# Altium schematic sheet Master.SchDoc
size 431 x 279 mm; SheetNumber: 1; SheetTotal: 6
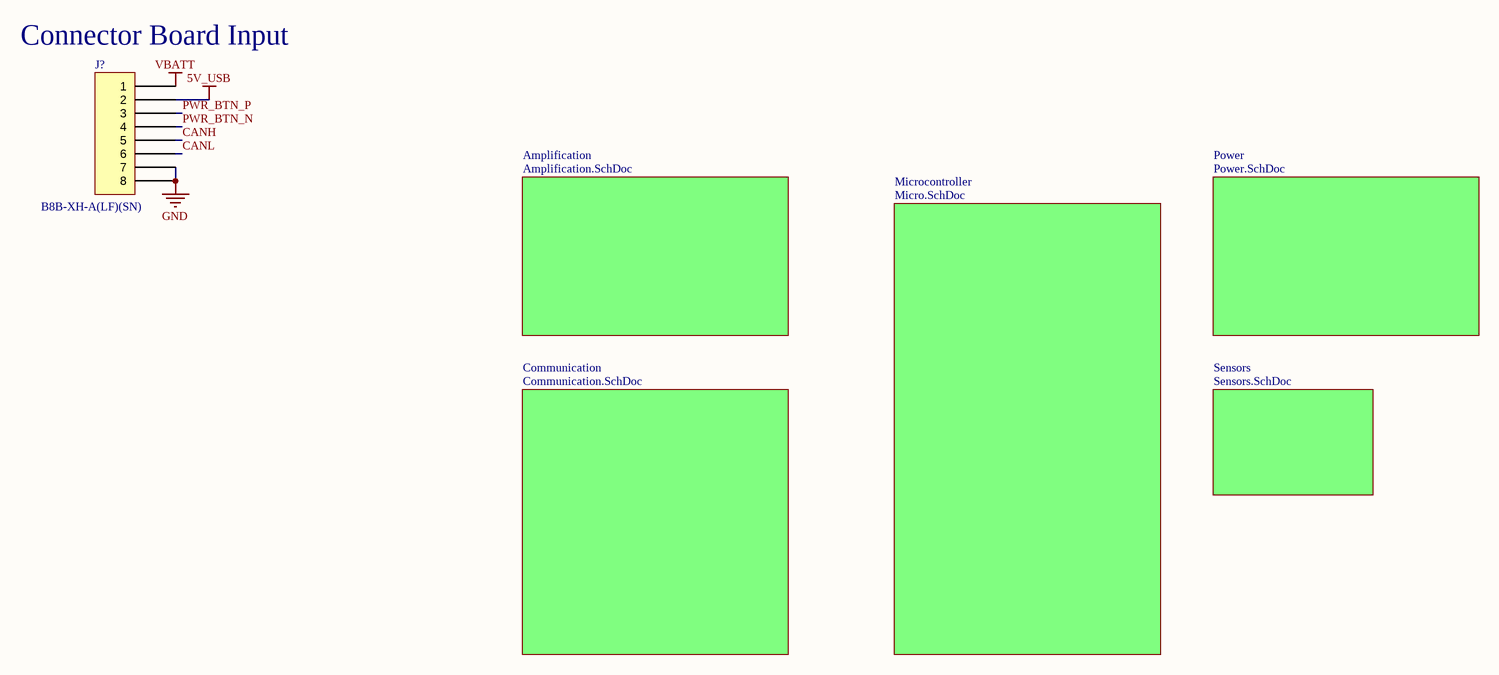
[diagram p0: Master.SchDoc]

## Parts
J?  B8B-XH-A(LF)(SN)  [JST XH B8B-XH-A]

## Sub-sheets
Amplification = Amplification.SchDoc: no entries
Communication = Communication.SchDoc: no entries
Microcontroller = Micro.SchDoc: no entries
Power = Power.SchDoc: no entries
Sensors = Sensors.SchDoc: no entries

## Nets
5V_USB: J?.2
GND: J?.7 J?.8
VBATT: J?.1
CANH: J?.5
CANL: J?.6
PWR_BTN_N: J?.4
PWR_BTN_P: J?.3

## Notes on the sheet
- (near J?) Connector Board Input
- DWG. NO.
- REV.
- SHT.
- THIS DOCUMENT AND THE DATA DISCLOSED HEREIN OR HEREWITH IS THE PROPERTY OF ALTIUM LIMITED AND MAY BE FREELY DISTRIBUTED IN WHOLE. NO RIGHTS ARE RESERVED OR EXPRESS OR IMPLIED WARANTEE GIVEN.
- REVISION
- DESCRIPTION
- DATE
- APPROVED
- ENG:
- APPROVALS
- PROJECT
- DSN:
- CHK:
- REFERENCE DOCUMENTS
- PROJECT REVISION:
- TITLE
- DOCUMENT REVISION:
- DESIGN ITEM:
- BOM:
- FAB DWG:
- PCB DWG:
- ASSY DWG:
- SCALE:
- SIZE
- B
- CAGE CODE
- FILE NAME
- DWG NO.
- SHEET
- OF
- REV

## Library data of the parts
J? = B8B-XH-A(LF)(SN): CONN HEADER VERT 8POS 2.5MM; Manufacturer: JST Sales America Inc.; Contact Length - Post: 0.134" (3.40mm); Current Rating (Amps): 3A; Material Flammability Rating: UL94 V-0; Number of Positions: 8; Number of Positions Loaded: All; Pitch - Mating: 0.098" (2.50mm); Shrouding: Shrouded - 4 Wall; Style: Board to Cable/Wire; Voltage Rating: 250V; Part Number: B8B-XH-A(LF)(SN); ComponentLink1Description: Datasheet; ComponentLink1URL: http://www.jst-mfg.com/product/pdf/eng/eXH.pdf; ComponentLink2Description: DigiKey Link; ComponentLink2URL: http://digikey.com/product-detail/en/jst-sales-america-inc/B8B-XH-A-LF-SN/455-2251-ND/1651049; Connector Type: Header; Contact Finish - Mating: Tin; Contact Finish - Post: Tin; Contact Material: Brass; Contact Shape: Square; Contact Type: Male Pin; Fastening Type: Detent Lock; Insulation Color: Natural; Insulation Height: 0.276" (7.00mm); Insulation Material: Polyamide (PA66), Nylon 6/6; LastUpdated: 2020-01-12 11:47:22 PM; Lifecycle Status: Active; Minimum Order: 1; Mounting Type: Through Hole; Number of Rows: 1; Operating Temperature: -25°C ~ 85°C; Packaging: Bulk; PartId: 73; Part Status: Active; Price: 0.36; Series: XH; Supplier 1: DigiKey; Supplier Part Number 1: 455-2251-ND; Termination: Press-Fit, Solder